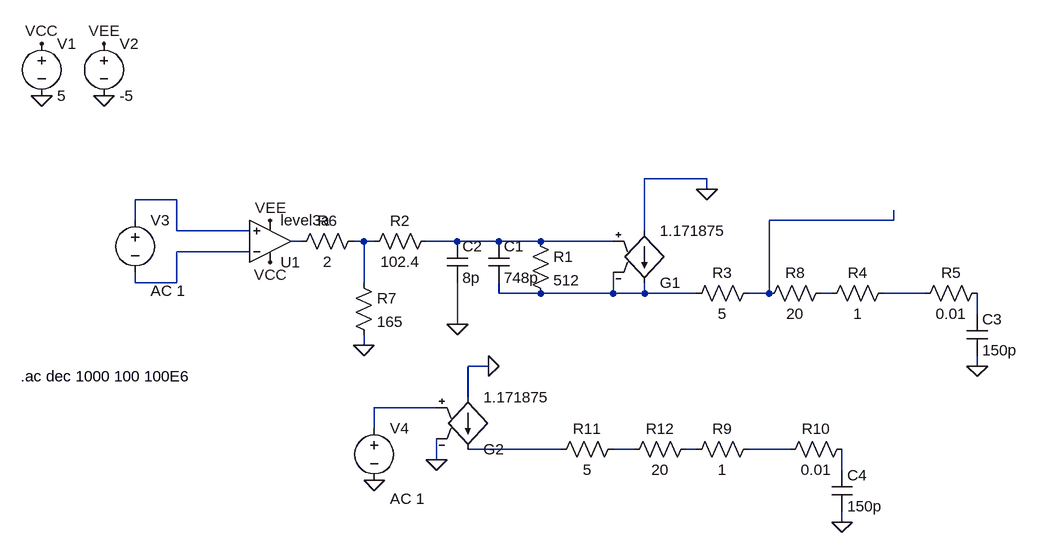
[diagram p0: schematic Draft2.asc]
Draft2.asc, the LTspice schematic file:
Version 4
SHEET 1 1260 680
WIRE 752 80 656 80
WIRE 752 96 752 80
WIRE -64 112 -128 112
WIRE -128 144 -128 112
WIRE 1040 144 1040 128
WIRE 1040 144 848 144
WIRE -64 160 -64 112
WIRE 48 160 -64 160
WIRE 656 160 656 80
WIRE 128 176 112 176
WIRE 224 176 208 176
WIRE 240 176 224 176
WIRE 368 176 320 176
WIRE 432 176 368 176
WIRE 496 176 432 176
WIRE 608 176 496 176
WIRE 48 192 -64 192
WIRE -128 240 -128 224
WIRE -64 240 -64 192
WIRE -64 240 -128 240
WIRE 224 240 224 176
WIRE 432 256 432 240
WIRE 496 256 432 256
WIRE 608 256 608 224
WIRE 608 256 496 256
WIRE 656 256 656 240
WIRE 656 256 608 256
WIRE 736 256 656 256
WIRE 848 256 848 144
WIRE 848 256 816 256
WIRE 944 256 928 256
WIRE 1088 256 1024 256
WIRE 1168 288 1168 256
WIRE 368 304 368 240
WIRE 224 336 224 320
WIRE 416 368 384 368
WIRE 1168 368 1168 352
WIRE 384 416 384 368
WIRE 336 432 240 432
WIRE 240 464 240 432
WIRE 528 496 384 496
WIRE 640 496 608 496
WIRE 736 496 720 496
WIRE 880 496 816 496
WIRE 336 512 336 480
WIRE 960 528 960 496
WIRE 960 608 960 592
FLAG -176 -48 0
FLAG -272 -48 0
FLAG -272 -128 VCC
FLAG 80 208 VCC
FLAG -176 -128 VEE
FLAG 80 144 VEE
FLAG 752 96 0
FLAG 368 304 0
FLAG 1168 368 0
FLAG 224 336 0
FLAG 960 608 0
FLAG 336 512 0
FLAG 416 368 0
FLAG 240 544 0
SYMBOL OpAmps\\UniversalOpAmp3 80 176 M180
SYMATTR InstName U1
SYMATTR Value2 Avol=10000 GBW=80Meg Slew=10Meg
SYMATTR SpiceLine Ilimit=25m Rail=0 Vos=0 Phimargin=30
SYMBOL voltage -272 -144 R0
WINDOW 123 0 0 Left 0
WINDOW 39 0 0 Left 0
SYMATTR InstName V1
SYMATTR Value 5
SYMBOL voltage -176 -144 R0
WINDOW 123 0 0 Left 0
WINDOW 39 0 0 Left 0
SYMATTR InstName V2
SYMATTR Value -5
SYMBOL g2 656 256 M180
SYMATTR InstName G1
SYMATTR Value 1.171875
SYMBOL res 480 160 R0
SYMATTR InstName R1
SYMATTR Value 512
SYMBOL cap 416 176 R0
SYMATTR InstName C1
SYMATTR Value 748p
SYMBOL cap 352 176 R0
SYMATTR InstName C2
SYMATTR Value 8p
SYMBOL res 336 160 R90
WINDOW 0 0 56 VBottom 2
WINDOW 3 32 56 VTop 2
SYMATTR InstName R2
SYMATTR Value 102.4
SYMBOL voltage -128 128 R0
WINDOW 123 24 124 Left 2
WINDOW 39 0 0 Left 0
SYMATTR InstName V3
SYMATTR Value ""
SYMATTR Value2 AC 1
SYMBOL cap 1152 288 R0
SYMATTR InstName C3
SYMATTR Value 150p
SYMBOL res 1040 240 R90
WINDOW 0 0 56 VBottom 2
WINDOW 3 32 56 VTop 2
SYMATTR InstName R4
SYMATTR Value 1
SYMBOL res 1184 240 R90
WINDOW 0 0 56 VBottom 2
WINDOW 3 32 56 VTop 2
SYMATTR InstName R5
SYMATTR Value 0.01
SYMBOL res 224 160 R90
WINDOW 0 0 56 VBottom 2
WINDOW 3 32 56 VTop 2
SYMATTR InstName R6
SYMATTR Value 2
SYMBOL res 208 224 R0
SYMATTR InstName R7
SYMATTR Value 165
SYMBOL res 832 240 R90
WINDOW 0 0 56 VBottom 2
WINDOW 3 32 56 VTop 2
SYMATTR InstName R3
SYMATTR Value 5
SYMBOL res 944 240 R90
WINDOW 0 0 56 VBottom 2
WINDOW 3 32 56 VTop 2
SYMATTR InstName R8
SYMATTR Value 20
SYMBOL cap 944 528 R0
SYMATTR InstName C4
SYMATTR Value 150p
SYMBOL res 832 480 R90
WINDOW 0 0 56 VBottom 2
WINDOW 3 32 56 VTop 2
SYMATTR InstName R9
SYMATTR Value 1
SYMBOL res 976 480 R90
WINDOW 0 0 56 VBottom 2
WINDOW 3 32 56 VTop 2
SYMATTR InstName R10
SYMATTR Value 0.01
SYMBOL res 624 480 R90
WINDOW 0 0 56 VBottom 2
WINDOW 3 32 56 VTop 2
SYMATTR InstName R11
SYMATTR Value 5
SYMBOL res 736 480 R90
WINDOW 0 0 56 VBottom 2
WINDOW 3 32 56 VTop 2
SYMATTR InstName R12
SYMATTR Value 20
SYMBOL g2 384 512 M180
SYMATTR InstName G2
SYMATTR Value 1.171875
SYMBOL voltage 240 448 R0
WINDOW 123 24 124 Left 2
WINDOW 39 0 0 Left 0
SYMATTR InstName V4
SYMATTR Value ""
SYMATTR Value2 AC 1
TEXT -304 384 Left 2 !.ac dec 1000 100 100E6

The netlist it stands for:
* Draft2.asc
XU1 N001 N006 VCC VEE N003 level3a Avol=10000 GBW=80Meg Slew=10Meg Ilimit=25m Rail=0 Vos=0 Phimargin=30  ; pins In+ In- V+ V- OUT
V1 VCC 0 5
V2 VEE 0 -5
G1 0 N007 N005 N007 1.171875
R1 N005 N007 512
C1 N005 N007 748p
C2 N005 0 8p
R2 N005 N004 102.4
V3 N001 N006 AC 1
C3 N010 0 150p
R4 N009 N008 1
R5 N010 N009 0.01
R6 N004 N003 2
R7 N004 0 165
R3 N002 N007 5
R8 N008 N002 20
C4 N016 0 150p
R9 N015 N014 1
R10 N016 N015 0.01
R11 N013 N012 5
R12 N014 N013 20
G2 0 N012 N011 0 1.171875
V4 N011 0 AC 1
.ac dec 1000 100 100E6
.backanno
.end